# Altium project RK3576-SMC (021.0 A0).PrjPCB (part 2 of 3)

## Sheet RK3576-SMC.PMIC_BUCK (0021.0 A0).SchDoc
size 420 x 297 mm; Scale: -; DocumentType: Схема электрическая принципиальная; DocumentGOSTLIt1: ㅤ; DocumentGOSTLIt2: ㅤ; DocumentGOSTLIt3: ㅤ; DocumentGOSTNote: Элементы, отмеченные *, используются при трассировке печатной платы, в состав модуля не включаются; SheetNumber: 4; SheetTotal: 7; DocumentTypeShort: Э3; DocumentInvertoryNumber: ㅤ
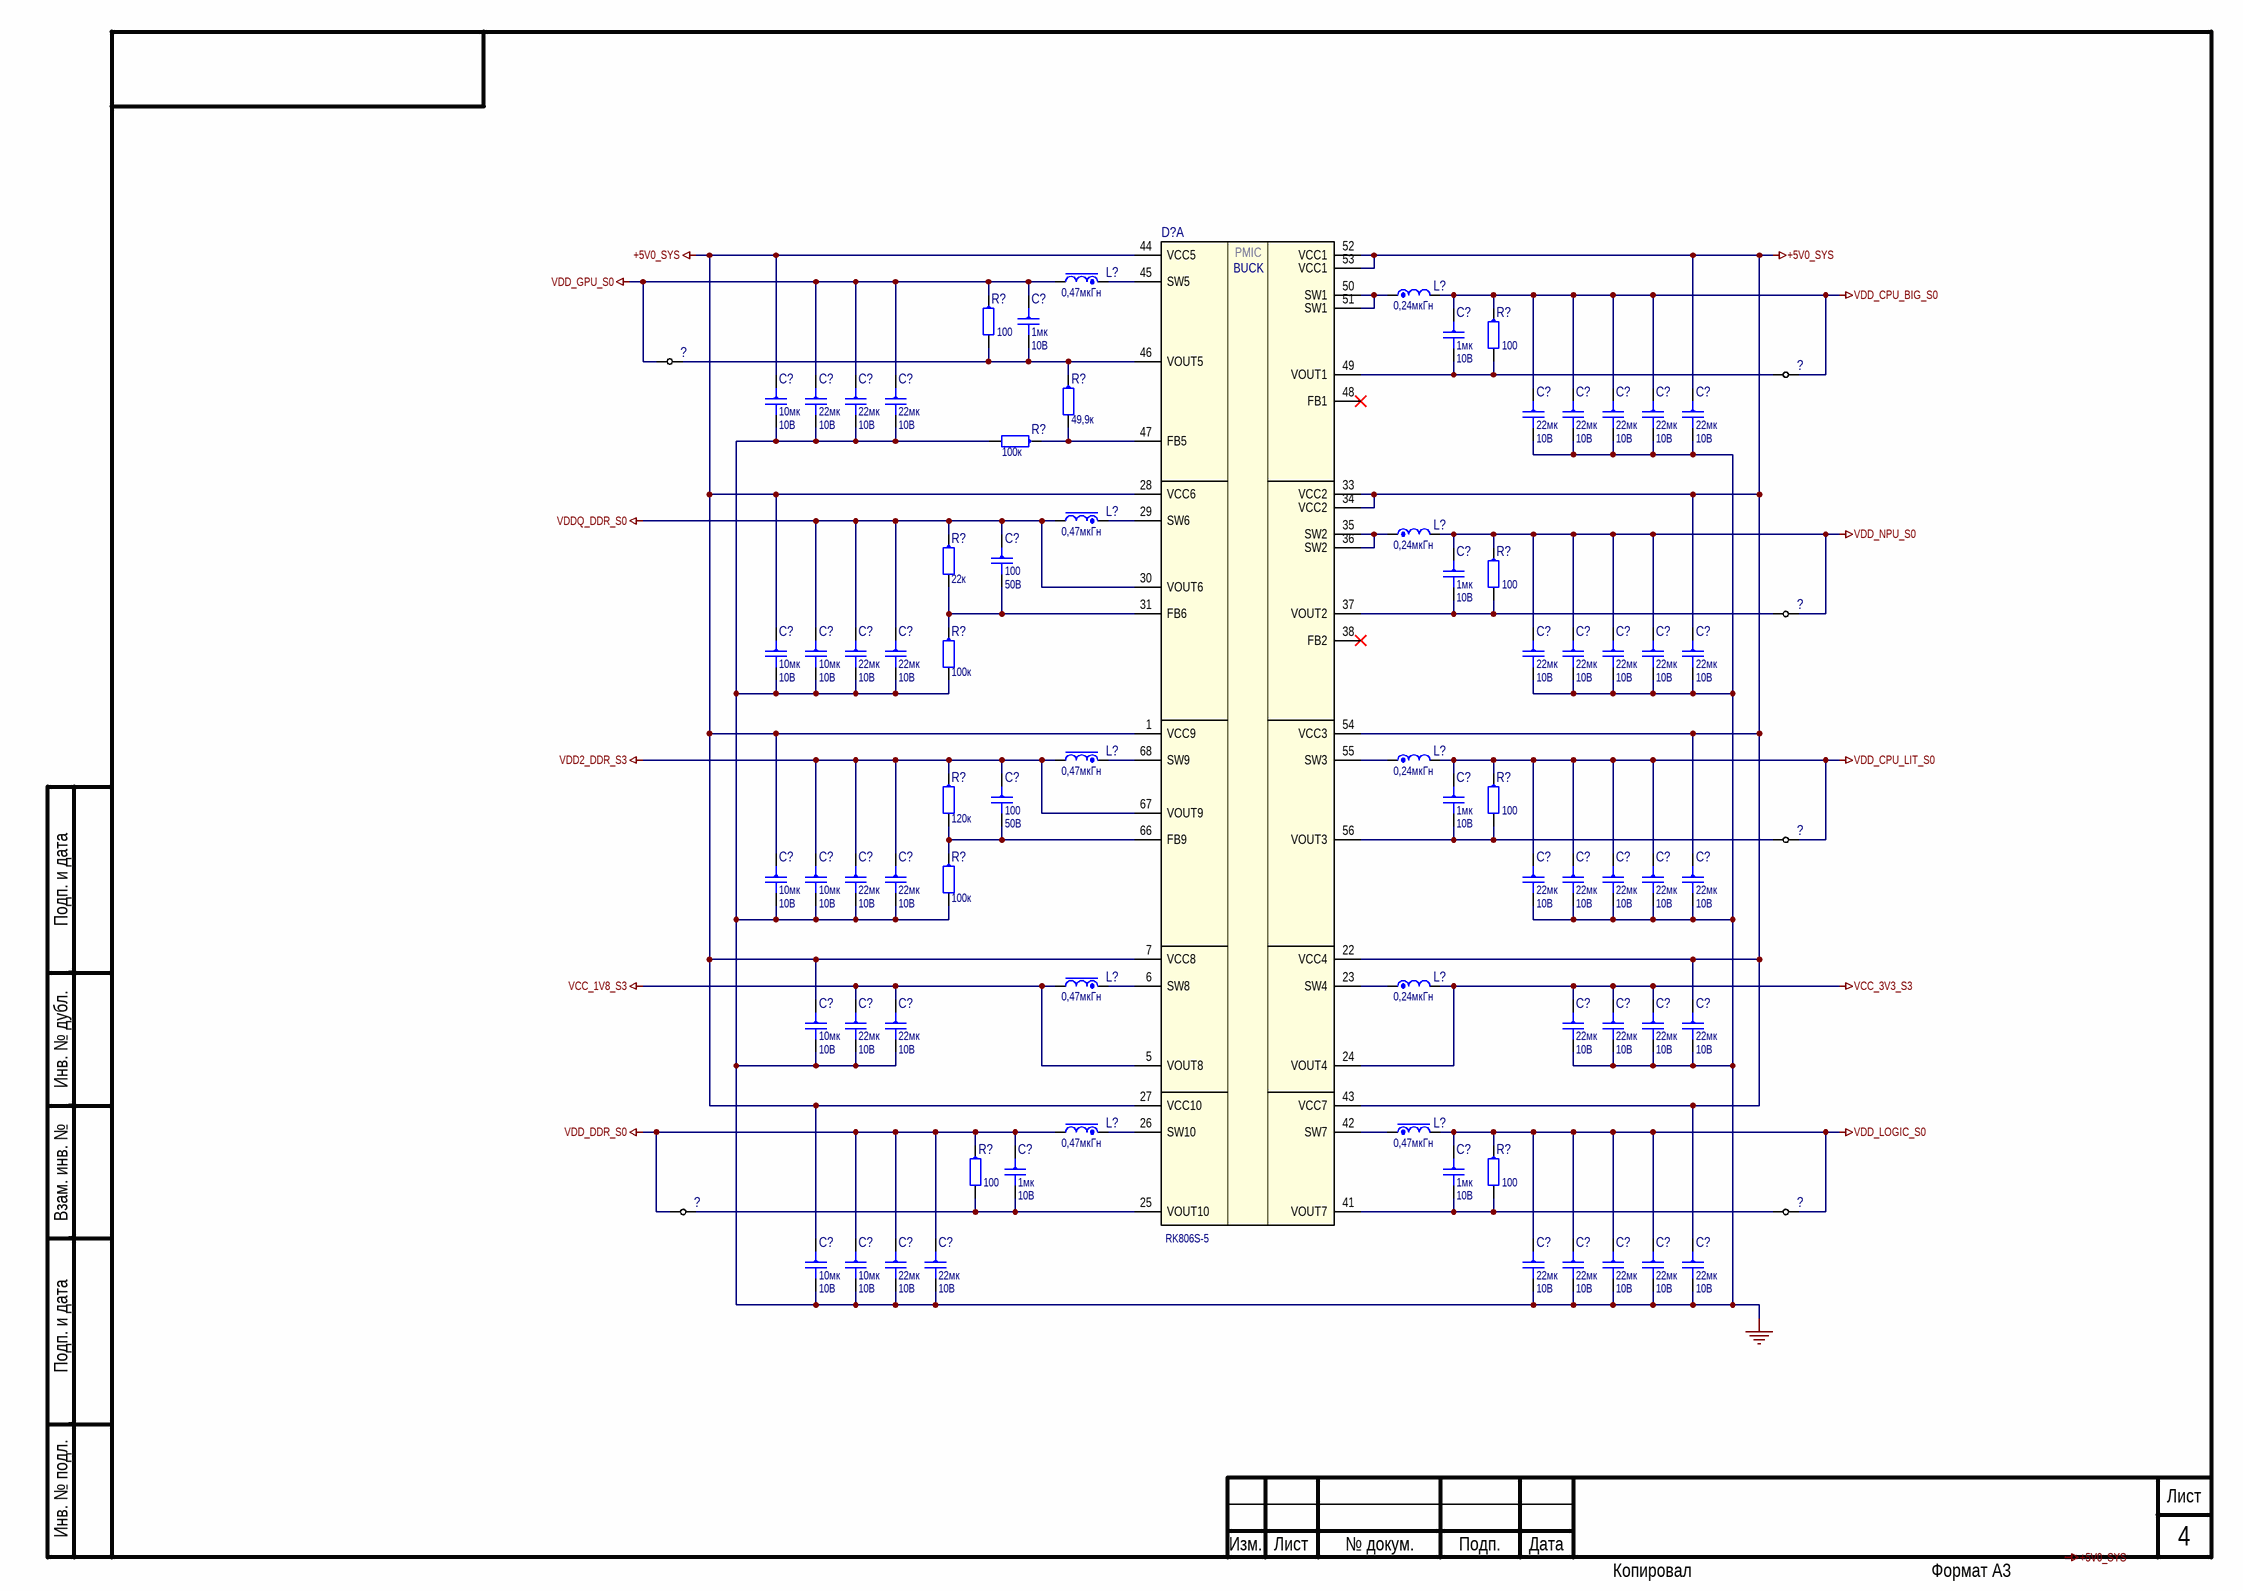
[diagram p3: RK3576-SMC.PMIC_BUCK (0021.0 A0).SchDoc]

### Parts
(Parts that share a designator on the sheet are numbered #1, #2 ... from top to bottom, then left to right.)
?#36  NetTie  [NetTie_0_6-1_25mm_close]  (value not drawn)  (net tie, no BOM)
?#37  NetTie  [NetTie_0_6-1_25mm_close]  (value not drawn)  (net tie, no BOM)
?#38  NetTie  [NetTie_0_6-1_25mm_close]  (value not drawn)  (net tie, no BOM)
?#39  NetTie  [NetTie_0_6-1_25mm_close]  (value not drawn)  (net tie, no BOM)
?#40  NetTie  [NetTie_0_6-1_25mm_close]  (value not drawn)  (net tie, no BOM)
?#41  NetTie  [NetTie_0_6-1_25mm_close]  (value not drawn)  (net tie, no BOM)
C?#1  1мк  Напряжение: 10В  [capc1005x55n]
C?#2  1мк  Напряжение: 10В  [capc1005x55n]
C?#3  10мк  Напряжение: 10В  [capc1608x100n]
C?#4  22мк  Напряжение: 10В  [capc1608x100n]
C?#5  22мк  Напряжение: 10В  [capc1608x100n]
C?#6  22мк  Напряжение: 10В  [capc1608x100n]
C?#7  22мк  Напряжение: 10В  [capc1608x100n]
C?#8  22мк  Напряжение: 10В  [capc1608x100n]
C?#9  22мк  Напряжение: 10В  [capc1608x100n]
C?#10  22мк  Напряжение: 10В  [capc1608x100n]
C?#11  22мк  Напряжение: 10В  [capc1608x100n]
C?#12  100  Напряжение: 50В  [capc1005x55n]
C?#13  1мк  Напряжение: 10В  [capc1005x55n]
C?#14  10мк  Напряжение: 10В  [capc1608x100n]
C?#15  10мк  Напряжение: 10В  [capc1608x100n]
C?#16  22мк  Напряжение: 10В  [capc1608x100n]
C?#17  22мк  Напряжение: 10В  [capc1608x100n]
C?#18  22мк  Напряжение: 10В  [capc1608x100n]
C?#19  22мк  Напряжение: 10В  [capc1608x100n]
C?#20  22мк  Напряжение: 10В  [capc1608x100n]
C?#21  22мк  Напряжение: 10В  [capc1608x100n]
C?#22  22мк  Напряжение: 10В  [capc1608x100n]
C?#23  100  Напряжение: 50В  [capc1005x55n]
C?#24  1мк  Напряжение: 10В  [capc1005x55n]
C?#25  10мк  Напряжение: 10В  [capc1608x100n]
C?#26  10мк  Напряжение: 10В  [capc1608x100n]
C?#27  22мк  Напряжение: 10В  [capc1608x100n]
C?#28  22мк  Напряжение: 10В  [capc1608x100n]
C?#29  22мк  Напряжение: 10В  [capc1608x100n]
C?#30  22мк  Напряжение: 10В  [capc1608x100n]
C?#31  22мк  Напряжение: 10В  [capc1608x100n]
C?#32  22мк  Напряжение: 10В  [capc1608x100n]
C?#33  22мк  Напряжение: 10В  [capc1608x100n]
C?#34  10мк  Напряжение: 10В  [capc1608x100n]
C?#35  22мк  Напряжение: 10В  [capc1608x100n]
C?#36  22мк  Напряжение: 10В  [capc1608x100n]
C?#37  22мк  Напряжение: 10В  [capc1608x100n]
C?#38  22мк  Напряжение: 10В  [capc1608x100n]
C?#39  22мк  Напряжение: 10В  [capc1608x100n]
C?#40  22мк  Напряжение: 10В  [capc1608x100n]
C?#41  1мк  Напряжение: 10В  [capc1005x55n]
C?#42  1мк  Напряжение: 10В  [capc1005x55n]
C?#43  10мк  Напряжение: 10В  [capc1608x100n]
C?#44  10мк  Напряжение: 10В  [capc1608x100n]
C?#45  22мк  Напряжение: 10В  [capc1608x100n]
C?#46  22мк  Напряжение: 10В  [capc1608x100n]
C?#47  22мк  Напряжение: 10В  [capc1608x100n]
C?#48  22мк  Напряжение: 10В  [capc1608x100n]
C?#49  22мк  Напряжение: 10В  [capc1608x100n]
C?#50  22мк  Напряжение: 10В  [capc1608x100n]
C?#51  22мк  Напряжение: 10В  [capc1608x100n]
D?#1  RK806S-5  [qfn35p700x700x90-69_hsn]  (part A of 3)
L?#1  0,47мкГн  [indm2016x100n]
L?#2  0,24мкГн  [inddfn250x200x120-2n_v1]
L?#3  0,47мкГн  [indm2016x100n]
L?#4  0,24мкГн  [inddfn250x200x120-2n_v1]
L?#5  0,47мкГн  [indm2016x100n]
L?#6  0,24мкГн  [inddfn250x200x120-2n_v1]
L?#7  0,47мкГн  [indm2016x100n]
L?#8  0,24мкГн  [inddfn250x200x120-2n_v1]
L?#9  0,47мкГн  [indm2016x100n]
L?#10  0,47мкГн  [indm2016x100n]
R?#52  100  [resc1005x40n]
R?#53  100  [resc1005x40n]
R?#54  49,9к  [resc1005x40n]
R?#55  100к  [resc1005x40n]
R?#56  22к  [resc1005x40n]
R?#57  100  [resc1005x40n]
R?#58  100к  [resc1005x40n]
R?#59  120к  [resc1005x40n]
R?#60  100  [resc1005x40n]
R?#61  100к  [resc1005x40n]
R?#62  100  [resc1005x40n]
R?#63  100  [resc1005x40n]

### Nets
+5V0_SYS: C?#3.1 C?#11.1 C?#14.1 C?#22.1 C?#25.1 C?#33.1 C?#34.1 C?#40.1 C?#43.1 C?#51.1 D?#1.1(VCC9) D?#1.7(VCC8) D?#1.22(VCC4) D?#1.27(VCC10) D?#1.28(VCC6) D?#1.33(VCC2) D?#1.34(VCC2) D?#1.43(VCC7) D?#1.44(VCC5) D?#1.52(VCC1) D?#1.53(VCC1) D?#1.54(VCC3)
SOM.GND: C?#3.2 C?#4.2 C?#5.2 C?#6.2 C?#7.2 C?#8.2 C?#9.2 C?#10.2 C?#11.2 C?#14.2 C?#15.2 C?#16.2 C?#17.2 C?#18.2 C?#19.2 C?#20.2 C?#21.2 C?#22.2 C?#25.2 C?#26.2 C?#27.2 C?#28.2 C?#29.2 C?#30.2 C?#31.2 C?#32.2 C?#33.2 C?#34.2 C?#35.2 C?#36.2 C?#37.2 C?#38.2 C?#39.2 C?#40.2 C?#43.2 C?#44.2 C?#45.2 C?#46.2 C?#47.2 C?#48.2 C?#49.2 C?#50.2 C?#51.2 R?#55.2 R?#58.2 R?#61.2
VCC_1V8_S3: C?#35.1 C?#36.1 D?#1.5(VOUT8) L?#7.2
VCC_3V3_S3: C?#37.1 C?#38.1 C?#39.1 D?#1.24(VOUT4) L?#8.2
VDD2_DDR_S3: C?#23.1 C?#26.1 C?#27.1 C?#28.1 D?#1.67(VOUT9) L?#5.2 R?#59.1
VDD_CPU_BIG_S0: ?#37.2 C?#2.1 C?#7.1 C?#8.1 C?#9.1 C?#10.1 L?#2.2 R?#53.1
VDD_CPU_LIT_S0: ?#39.2 C?#24.1 C?#29.1 C?#30.1 C?#31.1 C?#32.1 L?#6.2 R?#60.1
VDD_DDR_S0: ?#40.1 C?#41.1 C?#44.1 C?#45.1 C?#46.1 L?#9.2 R?#62.1
VDD_GPU_S0: ?#36.1 C?#1.1 C?#4.1 C?#5.1 C?#6.1 L?#1.2 R?#52.1
VDD_LOGIC_S0: ?#41.2 C?#42.1 C?#47.1 C?#48.1 C?#49.1 C?#50.1 L?#10.2 R?#63.1
VDD_NPU_S0: ?#38.2 C?#13.1 C?#18.1 C?#19.1 C?#20.1 C?#21.1 L?#4.2 R?#57.1
VDDQ_DDR_S0: C?#12.1 C?#15.1 C?#16.1 C?#17.1 D?#1.30(VOUT6) L?#3.2 R?#56.1
Net?#36_2: ?#36.2 C?#1.2 D?#1.46(VOUT5) R?#52.2 R?#54.1
Net?#37_1: ?#37.1 C?#2.2 D?#1.49(VOUT1) R?#53.2
Net?#38_1: ?#38.1 C?#13.2 D?#1.37(VOUT2) R?#57.2
Net?#39_1: ?#39.1 C?#24.2 D?#1.56(VOUT3) R?#60.2
Net?#40_2: ?#40.2 C?#41.2 D?#1.25(VOUT10) R?#62.2
Net?#41_1: ?#41.1 C?#42.2 D?#1.41(VOUT7) R?#63.2
NetC?#12_2: C?#12.2 D?#1.31(FB6) R?#56.2 R?#58.1
NetC?#23_2: C?#23.2 D?#1.66(FB9) R?#59.2 R?#61.1
NetD?#1_6: D?#1.6(SW8) L?#7.1
NetD?#1_23: D?#1.23(SW4) L?#8.1
NetD?#1_26: D?#1.26(SW10) L?#9.1
NetD?#1_29: D?#1.29(SW6) L?#3.1
NetD?#1_35: D?#1.35(SW2) D?#1.36(SW2) L?#4.1
NetD?#1_42: D?#1.42(SW7) L?#10.1
NetD?#1_45: D?#1.45(SW5) L?#1.1
NetD?#1_47: D?#1.47(FB5) R?#54.2 R?#55.1
NetD?#1_50: D?#1.50(SW1) D?#1.51(SW1) L?#2.1
NetD?#1_55: D?#1.55(SW3) L?#6.1
NetD?#1_68: D?#1.68(SW9) L?#5.1

Not connected (* = marked no-connect by the designer): D?#1 38(FB2)* 48(FB1)*

### Notes on the sheet
- Labels drawn without touching a wire or pin: +5V0_SYS
- Подп. и дата
- Инв. № дубл.
- Взам. инв. №
- Инв. № подл.
- Изм.
- Лист
- № докум.
- Подп.
- Дата
- Копировал
- Формат А3
- (in symbol RK806S-5, part A) PMIC; BUCK

### Library data of the parts
?#36-?#41 = NetTie_0.6-1.25_Close: Part_ID: ATB-00257; Rule: UNIONINDEX=0|RULEKIND=Clearance|NETSCOPE=DifferentNets|LAYERKIND=SameLayer|NAME=Schematic Clearance Constraint|GAP=0mil|GENERICCLEARANCE=0mil|IGNOREPADTOPADCLEARANCEINFOOTPRINT=TRUE|OBJECTCLEARANCES= |UNIT=Metric; Rule: UNIONINDEX=0|RULEKIND=PolygonConnect|NETSCOPE=AnyNet|LAYERKIND=SameLayer|NAME=Schematic Polygon Connect Style|CONNECTSTYLE=Direct|RELIEFCONDUCTORWIDTH=10mil|RELIEFENTRIES=4|POLYGONRELIEFANGLE=45 Angle|AIRGAPWIDTH=10mil|UNIT=Metric; Rule: UNIONINDEX=0|RULEKIND=ShortCircuit|NETSCOPE=AnyNet|LAYERKIND=SameLayer|NAME=Schematic Short-Circuit Constraint|ALLOWED=TRUE|UNIT=Metric; Тип ЭКБ: Элементы; Тип компонента: Перемычка; Автор: Чепиков И.В.; Part Number: NetTie_0.6-1.25_Close; Наименование: NetTie_0.6-1.25_Close; Value: -; Part_Number: NetTie_0.6-1.25_Close; Дата: 11.11.2024; Device: NetTie_0.6-1.25_Close; NameFromManufacturer: NetTie_0.6-1.25_Close
C?#1 C?#2 C?#13 C?#24 C?#41 C?#42 = CC0402KRX5R6BB105: Part_ID: ATB-00690; Manufacturer: Yageo; Schematic_Part: C_min_val,C_min,C_val,C; Тип ЭКБ: Конденсаторы; Наименование: 0402-X5R-10V-1uF±10%; Тип компонента: Конденсатор керамический; Value: 1uF; Voltage: 10V; Температура: -55 +85; PCB_Footprint: capc1005x55,capc1005x55n; Тип корпуса: Chip; Видоразмер: 1005; Вариант установки: Поверхностный; Код ERP: E2-00028722; Photo: Photos\Photos\Yageo_Capacitors.jpg; Автор: Чепиков И.В.; Точность: 10%; Device: 0402-X5R-10V-1uF±10%_Yageo; Library Ref 2: C; Library Ref 3: Cshort; Part Number: CC0402KRX5R6BB105; Datasheet: Datasheets\Capacitors\UPY-GPHC_X5R_4V-to-50V_30.pdf; Номинал: 1мк; Part_Number: CC0402KRX5R6BB105; Height: 0.55; Производитель: Yageo; Website: https://www.yageo.com/upload/media/product/productsearch/datasheet/mlcc/UPY-GPHC_X5R_4V-to-50V_30.pdf; Дата: 23.09.2024; ComponentLink1Description: UPY-GPHC_X5R_4V-to-50V_30.pdf; ComponentLink1URL: https://www.yageo.com/upload/media/product/productsearch/datasheet/mlcc/UPY-GPHC_X5R_4V-to-50V_30.pdf; NameFromManufacturer: CC0402KRX5R6BB105; Original PN: CC0402KRX5R6BB105
C?#3 C?#14 C?#15 C?#25 C?#26 C?#34 C?#43 C?#44 = CC0603KRX5R6BB106: Part_ID: ATB-01068; Manufacturer: Yageo; Schematic_Part: C_min_val,C_min,C_val,C; Тип ЭКБ: Конденсаторы; Наименование: 0603-X5R-10V-10uF±10%; Тип компонента: Конденсатор керамический; Value: 10uF; Voltage: 10V; Температура: -55 +85; Тип корпуса: Chip; Видоразмер: 1608; Вариант установки: Поверхностный; Код ERP: E2-00029011; Photo: Photos\Photos\Yageo_Capacitors.jpg; Автор: Чепиков И.В.; Точность: 10%; Device: 0603-X5R-10V-10uF±10%_Yageo; Library Ref 2: C; Library Ref 3: Cshort; Part Number: CC0603KRX5R6BB106; Datasheet: Datasheets\Capacitors\UPY-GPHC_X5R_4V-to-50V_30.pdf; Номинал: 10мк; Part_Number: CC0603KRX5R6BB106; PCB_Footprint: capc1608x100n; Height: 1; Производитель: Yageo; Website: https://www.yageo.com/upload/media/product/productsearch/datasheet/mlcc/UPY-GPHC_X5R_4V-to-50V_30.pdf; Дата: 25.09.2024; ComponentLink1Description: UPY-GPHC_X5R_4V-to-50V_30.pdf; ComponentLink1URL: https://www.yageo.com/upload/media/product/productsearch/datasheet/mlcc/UPY-GPHC_X5R_4V-to-50V_30.pdf; NameFromManufacturer: CC0603KRX5R6BB106; Original PN: CC0603KRX5R6BB106
C?#4-C?#11 C?#16-C?#22 C?#27-C?#33 C?#35-C?#40 C?#45-C?#51 = CC0603MRX5R6BB226: Part_ID: ATB-01072; Manufacturer: Yageo; Schematic_Part: C_min_val,C_min,C_val,C; Тип ЭКБ: Конденсаторы; Наименование: 0603-X5R-10V-22uF±20%; Тип компонента: Конденсатор керамический; Value: 22uF; Voltage: 10V; Температура: -55 +85; Тип корпуса: Chip; Видоразмер: 1608; Вариант установки: Поверхностный; Код ERP: E2-00006861; Photo: Photos\Photos\Yageo_Capacitors.jpg; Автор: Чепиков И.В.; Точность: 20%; Device: 0603-X5R-10V-22uF±20%_Yageo; Library Ref 2: C; Library Ref 3: Cshort; Part Number: CC0603MRX5R6BB226; Datasheet: Datasheets\Capacitors\UPY-GPHC_X5R_4V-to-50V_30.pdf; Номинал: 22мк; Part_Number: CC0603MRX5R6BB226; PCB_Footprint: capc1608x100n; Height: 1; Производитель: Yageo; Website: https://www.yageo.com/upload/media/product/productsearch/datasheet/mlcc/UPY-GPHC_X5R_4V-to-50V_30.pdf; Дата: 25.09.2024; ComponentLink1Description: UPY-GPHC_X5R_4V-to-50V_30.pdf; ComponentLink1URL: https://www.yageo.com/upload/media/product/productsearch/datasheet/mlcc/UPY-GPHC_X5R_4V-to-50V_30.pdf; NameFromManufacturer: CC0603MRX5R6BB226; Original PN: CC0603MRX5R6BB226
C?#12 C?#23 = CC0402JRNPO9BN101: Part_ID: ATB-03397; Manufacturer: Yageo; Schematic_Part: C_min_val,C_min,C_val,C; Тип ЭКБ: Конденсаторы; Наименование: 0402-NP0-50V-100pF±5%; Тип компонента: Конденсатор керамический; Value: 100pF; Voltage: 50V; Температура: -55 +125; PCB_Footprint: capc1005x55,capc1005x55n; Тип корпуса: Chip; Видоразмер: 1005; Вариант установки: Поверхностный; Photo: Photos\Photos\Yageo_Capacitors.jpg; Автор: Чепиков И.В.; Точность: 5%; Device: 0402-NP0-50V-100pF±5%_Yageo; Library Ref 2: C; Library Ref 3: Cshort; Part Number: CC0402JRNPO9BN101; Datasheet: Datasheets\Capacitors\UPY-GP_NP0_16V-to-250V_19.pdf; Номинал: 100; Part_Number: CC0402JRNPO9BN101; Height: 0.55; Производитель: Yageo; Website: https://www.yageo.com/upload/media/product/productsearch/datasheet/mlcc/UPY-GP_NP0_16V-to-250V_19.pdf; Дата: 15.10.2024; ComponentLink1Description: UPY-GP_NP0_16V-to-250V_19.pdf; ComponentLink1URL: https://www.yageo.com/upload/media/product/productsearch/datasheet/mlcc/UPY-GP_NP0_16V-to-250V_19.pdf; NameFromManufacturer: CC0402JRNPO9BN101; Original PN: CC0402JRNPO9BN101
D?#1 = RK806S-5: Power-management integrated circuit; Part_ID: ATB-08063; Manufacturer: Rockchip; Тип ЭКБ: Микросхемы; Тип компонента: Контроллеры; Voltage: 2.7 - 5.5; Температура: -40 +125; Тип корпуса: QFN7x7-68; Вариант установки: Поверхностный; Photo: Photos\Photos\Rockchip_RK806-1.jpg; Автор: Чепиков И.В.; Part Number: RK806S-5; Наименование: RK806S-5; Datasheet: Datasheets\Microcircuits\Rockchip_RK806S_Datasheet_V1.5.pdf; Schematic_Part: RK806-1; Value: RK806S-5; Part_Number: RK806S-5; PCB_Footprint: qfn35p700x700x90-69_hsn; Height: 0.9; Производитель: Rockchip; Дата: 16.09.2025; Device: RK806S-5; ComponentLink1Description: Rockchip_RK806S_Datasheet_V1.5.pdf; NameFromManufacturer: RK806S-5; Original PN: RK806S-5
L?#1 L?#3 L?#5 L?#7 L?#9 L?#10 = WIP201610P-R47ML: SMT 2016, 0,47 мкГн, 20%, 3,5 А; Part_ID: ATB-08092; Manufacturer: Inpaq; Schematic_Part: L,L_Core; Тип ЭКБ: Дроссели; Тип компонента: Дроссель; Value: 470nH; Температура: -40 +125; Тип корпуса: Molded; Вариант установки: Поверхностный; Photo: Photos\Photos\Inpaq_WIP201610P-R47ML.jpg; Автор: Чепиков И.В.; Library Ref 2: Lcore; ComponentLink1Description: WIP201610P_L_Series.pdf; ComponentLink1URL: https://www.lcsc.com/product-detail/C964105.html?s_z=n_WIP201610P-R47ML; Part Number: WIP201610P-R47ML; Наименование: WIP201610P-R47ML; Datasheet: Datasheets\Chokes\WIP201610P_L_Series.pdf; Номинал: 0,47мкГн; Part_Number: WIP201610P-R47ML; PCB_Footprint: indm2016x100n; Height: 1; Производитель: Inpaq; Website: https://www.lcsc.com/product-detail/C964105.html?s_z=n_WIP201610P-R47ML; Точность: 20%; Дата: 17.09.2025; Device: WIP201610P-R47ML; NameFromManufacturer: WIP201610P-R47ML; Original PN: WIP201610P-R47ML
L?#2 L?#4 L?#6 L?#8 = WPN252012HR24MT: SMT 2520, 0,24 мкГн, 20%, 4,05 А; Part_ID: ATB-10004; Manufacturer: Sunlord; Schematic_Part: L; Тип ЭКБ: Дроссели; Тип компонента: Катушка индуктивности; Value: 240nH; Температура: -40 +125; Тип корпуса: DFN; Вариант установки: Поверхностный; Код ERP: E2-00040440; Photo: Photos\Photos\Sunlord_WPN252012H1R0MT.jpg; Автор: Чепиков И.В.; ComponentLink1Description: WPN Series Sunlord.pdf; ComponentLink1URL: https://www.sunlordinc.com/uploads/files/20240807/cn/WPN%C2%A0Series%C2%A0of%C2%A0SMD%C2%A0Power%C2%A0Inductor.pdf; Part Number: WPN252012HR24MT; Наименование: WPN252012HR24MT; Datasheet: Datasheets\Chokes\WPN Series Sunlord.pdf; Номинал: 0,24мкГн; Part_Number: WPN252012HR24MT; PCB_Footprint: inddfn250x200x120-2n_v1; Height: 1.2; Производитель: Sunlord; Website: https://www.sunlordinc.com/uploads/files/20240807/cn/WPN%C2%A0Series%C2%A0of%C2%A0SMD%C2%A0Power%C2%A0Inductor.pdf; Точность: 20%; Дата: 27.05.2025; Device: WPN252012HR24MT; Library Ref 2: L; NameFromManufacturer: WPN252012HR24MT; Original PN: WPN252012HR24MT
R?#52 R?#53 R?#57 R?#60 R?#62 R?#63 = RC0402FR-07100RL: Резисторы (chip) общего назначения; Part_ID: ATB-00718; Manufacturer: Yageo; Schematic_Part: R_min_val,R_min,R_val,R; Наименование: 0402-0.063W-100-100ppm±1%; Voltage: 50V; Power: 0.063; Точность: ±1%; ТКС (от  -60 до +20 град): ± 100; Ряд: E24; Температура: -55 +155; Вариант установки: Поверхностный; Код ERP: E2-00025158; Photo: Photos\Photos\Yageo_RC0075-RC2512.jpg; Автор: Чепиков И.В.; Device: 0402-0.063W-100-100ppm±1%_Yageo; Library Ref 2: R; Part Number: RC0402FR-07100RL; Тип ЭКБ: Резисторы; Datasheet: Datasheets\Resistors\PYu-RC_Group_51_RoHS_L_12.pdf; Тип компонента: Резистор; Номинал: 100; Value: 100; ТКС (от +20 град до max): ± 100; Part_Number: RC0402FR-07100RL; PCB_Footprint: resc1005x40n; Тип корпуса: Chip; Height: 0.4; Производитель: Yageo; Website: https://www.yageo.com/upload/media/product/products/datasheet/rchip/PYu-RC_Group_51_RoHS_L_12.pdf; Дата: 25.09.2024; NameFromManufacturer: RC0402FR-07100RL; ComponentLink1URL: https://www.yageo.com/upload/media/product/products/datasheet/rchip/PYu-RC_Group_51_RoHS_L_12.pdf; ComponentLink1Description: PYu-RC_Group_51_RoHS_L_12.pdf; Original PN: RC0402FR-07100RL
R?#54 = RC0402FR-0749K9L: Резисторы (chip) общего назначения; Part_ID: ATB-08887; Manufacturer: Yageo; Schematic_Part: R_min_val,R_min,R_val,R; Наименование: 0402-0.063W-49.9K-100ppm±1%; Value: 49.9k; Voltage: 50V; Power: 0.063; Точность: ±1%; ТКС (от  -60 до +20 град): ± 100; Ряд: E96; Температура: -55 +155; Вариант установки: Поверхностный; Код ERP: E2-00000557; Photo: Photos\Photos\Yageo_RC0075-RC2512.jpg; Автор: Чепиков И.В.; Device: 0402-0.063W-49.9K-100ppm±1%_Yageo; Library Ref 2: R; Part Number: RC0402FR-0749K9L; Тип ЭКБ: Резисторы; Datasheet: Datasheets\Resistors\PYu-RC_Group_51_RoHS_L_12.pdf; Тип компонента: Резистор; Номинал: 49,9к; ТКС (от +20 град до max): ± 100; Part_Number: RC0402FR-0749K9L; PCB_Footprint: resc1005x40n; Тип корпуса: Chip; Height: 0.4; Производитель: Yageo; Website: https://www.yageo.com/upload/media/product/products/datasheet/rchip/PYu-RC_Group_51_RoHS_L_12.pdf; Дата: 23.12.2024; NameFromManufacturer: RC0402FR-0749K9L; ComponentLink1URL: https://www.yageo.com/upload/media/product/products/datasheet/rchip/PYu-RC_Group_51_RoHS_L_12.pdf; ComponentLink1Description: PYu-RC_Group_51_RoHS_L_12.pdf; Original PN: RC0402FR-0749K9L
R?#55 R?#58 R?#61 = RC0402FR-07100KL: Резисторы (chip) общего назначения; Part_ID: ATB-00517; Manufacturer: Yageo; Schematic_Part: R_min_val,R_min,R_val,R; Наименование: 0402-0.063W-100K-100ppm±1%; Value: 100k; Voltage: 50V; Power: 0.063; Точность: ±1%; ТКС (от  -60 до +20 град): ± 100; Ряд: E24; Температура: -55 +155; Вариант установки: Поверхностный; Код ERP: E2-00028265; Photo: Photos\Photos\Yageo_RC0075-RC2512.jpg; Автор: Чепиков И.В.; Device: 0402-0.063W-100K-100ppm±1%_Yageo; Library Ref 2: R; Part Number: RC0402FR-07100KL; Тип ЭКБ: Резисторы; Datasheet: Datasheets\Resistors\PYu-RC_Group_51_RoHS_L_12.pdf; Тип компонента: Резистор; Номинал: 100к; ТКС (от +20 град до max): ± 100; Part_Number: RC0402FR-07100KL; PCB_Footprint: resc1005x40n; Тип корпуса: Chip; Height: 0.4; Производитель: Yageo; Website: https://www.yageo.com/upload/media/product/products/datasheet/rchip/PYu-RC_Group_51_RoHS_L_12.pdf; Дата: 23.08.2024; NameFromManufacturer: RC0402FR-07100KL; ComponentLink1URL: https://www.yageo.com/upload/media/product/products/datasheet/rchip/PYu-RC_Group_51_RoHS_L_12.pdf; ComponentLink1Description: PYu-RC_Group_51_RoHS_L_12.pdf; Original PN: RC0402FR-07100KL
R?#56 = RC0402FR-0722KL: Резисторы (chip) общего назначения; Part_ID: ATB-00822; Manufacturer: Yageo; Schematic_Part: R_min_val,R_min,R_val,R; Наименование: 0402-0.063W-22K-100ppm±1%; Value: 22k; Voltage: 50V; Power: 0.063; Точность: ±1%; ТКС (от  -60 до +20 град): ± 100; Ряд: E24; Температура: -55 +155; Вариант установки: Поверхностный; Код ERP: E2-00028777; Photo: Photos\Photos\Yageo_RC0075-RC2512.jpg; Автор: Чепиков И.В.; Device: 0402-0.063W-22K-100ppm±1%_Yageo; Library Ref 2: R; Part Number: RC0402FR-0722KL; Тип ЭКБ: Резисторы; Datasheet: Datasheets\Resistors\PYu-RC_Group_51_RoHS_L_12.pdf; Тип компонента: Резистор; Номинал: 22к; ТКС (от +20 град до max): ± 100; Part_Number: RC0402FR-0722KL; PCB_Footprint: resc1005x40n; Тип корпуса: Chip; Height: 0.4; Производитель: Yageo; Website: https://www.yageo.com/upload/media/product/products/datasheet/rchip/PYu-RC_Group_51_RoHS_L_12.pdf; Дата: 25.09.2024; NameFromManufacturer: RC0402FR-0722KL; ComponentLink1URL: https://www.yageo.com/upload/media/product/products/datasheet/rchip/PYu-RC_Group_51_RoHS_L_12.pdf; ComponentLink1Description: PYu-RC_Group_51_RoHS_L_12.pdf; Original PN: RC0402FR-0722KL
R?#59 = RC0402FR-07120KL: Резисторы (chip) общего назначения; Part_ID: ATB-00834; Manufacturer: Yageo; Schematic_Part: R_min_val,R_min,R_val,R; Наименование: 0402-0.063W-120K-100ppm±1%; Value: 120k; Voltage: 50V; Power: 0.063; Точность: ±1%; ТКС (от  -60 до +20 град): ± 100; Ряд: E24; Температура: -55 +155; Вариант установки: Поверхностный; Код ERP: E2-00002809; Photo: Photos\Photos\Yageo_RC0075-RC2512.jpg; Автор: Чепиков И.В.; Device: 0402-0.063W-120K-100ppm±1%_Yageo; Library Ref 2: R; Part Number: RC0402FR-07120KL; Тип ЭКБ: Резисторы; Datasheet: Datasheets\Resistors\PYu-RC_Group_51_RoHS_L_12.pdf; Тип компонента: Резистор; Номинал: 120к; ТКС (от +20 град до max): ± 100; Part_Number: RC0402FR-07120KL; PCB_Footprint: resc1005x40n; Тип корпуса: Chip; Height: 0.4; Производитель: Yageo; Website: https://www.yageo.com/upload/media/product/products/datasheet/rchip/PYu-RC_Group_51_RoHS_L_12.pdf; Дата: 25.09.2024; NameFromManufacturer: RC0402FR-07120KL; ComponentLink1URL: https://www.yageo.com/upload/media/product/products/datasheet/rchip/PYu-RC_Group_51_RoHS_L_12.pdf; ComponentLink1Description: PYu-RC_Group_51_RoHS_L_12.pdf; Original PN: RC0402FR-07120KL

## Sheet RK3576-SMC.PMIC_LDO (0021.0 A0).SchDoc
size 420 x 297 mm; Scale: -; DocumentType: Схема электрическая принципиальная; DocumentGOSTLIt1: ㅤ; DocumentGOSTLIt2: ㅤ; DocumentGOSTLIt3: ㅤ; DocumentGOSTNote: Элементы, отмеченные *, используются при трассировке печатной платы, в состав модуля не включаются; SheetNumber: 5; SheetTotal: 7; DocumentTypeShort: Э3; DocumentInvertoryNumber: ㅤ
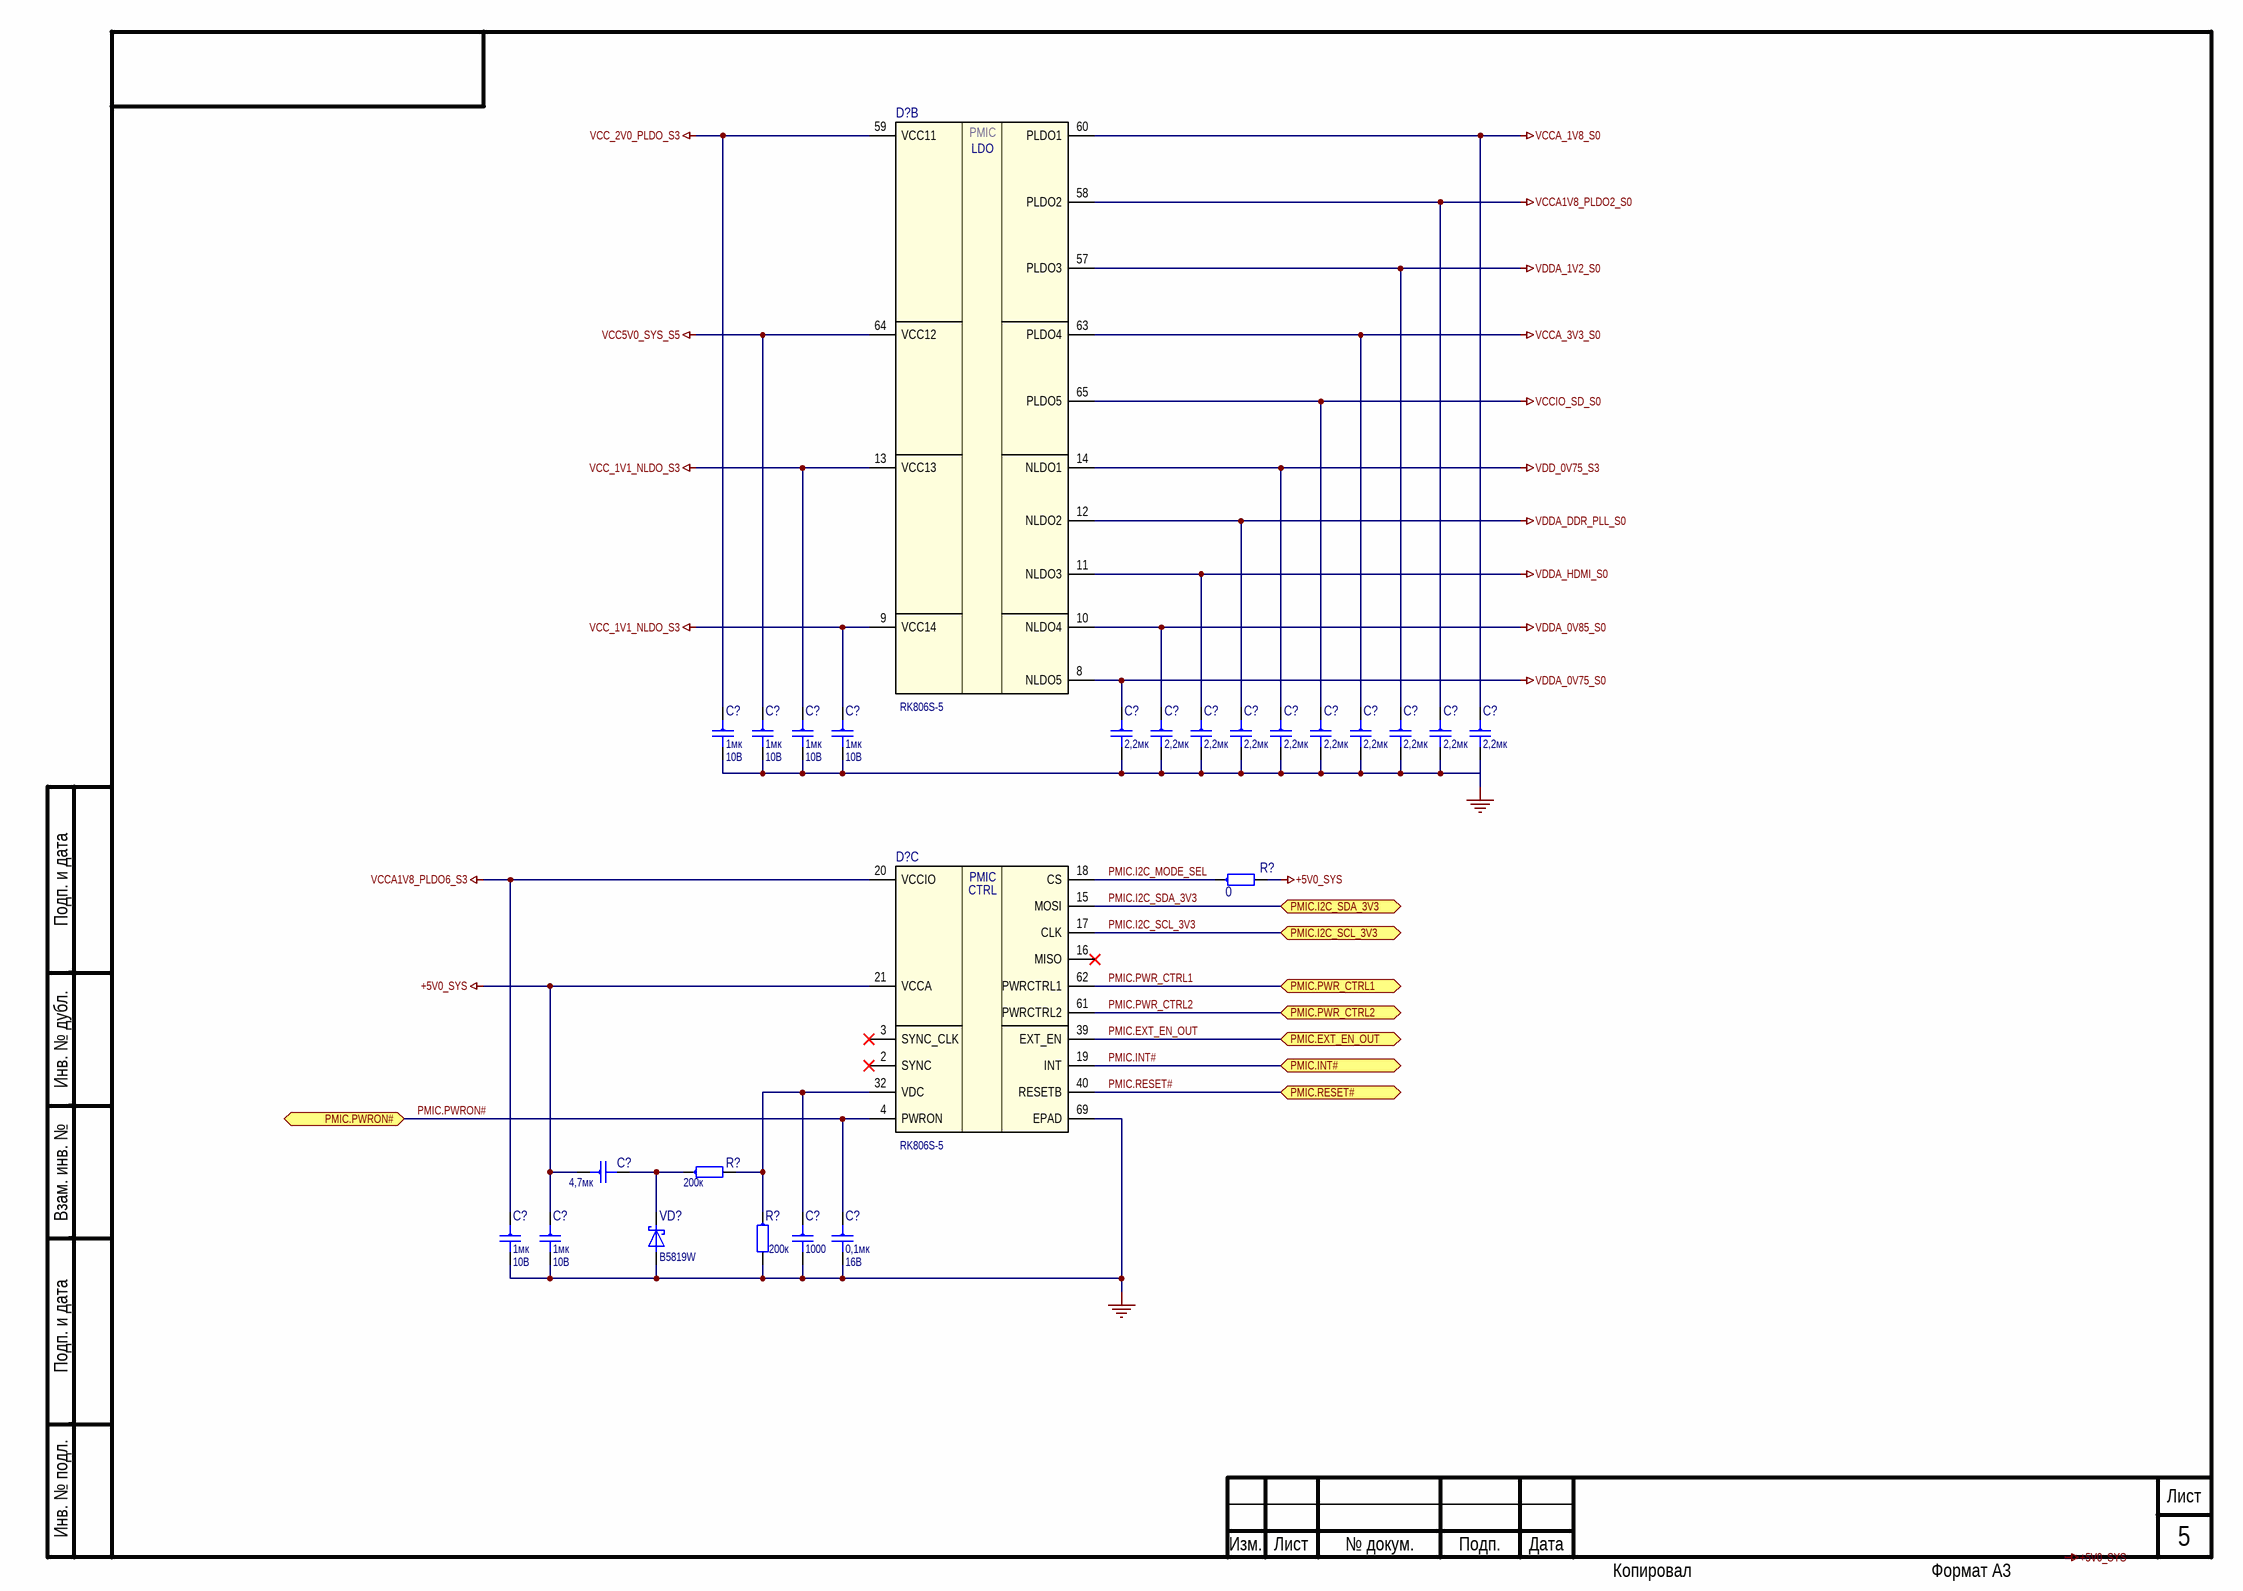
[diagram p4: RK3576-SMC.PMIC_LDO (0021.0 A0).SchDoc]

### Parts
(Parts that share a designator on the sheet are numbered #1, #2 ... from top to bottom, then left to right.)
C?#52  1мк  Напряжение: 10В  [capc1005x55n]
C?#53  1мк  Напряжение: 10В  [capc1005x55n]
C?#54  1мк  Напряжение: 10В  [capc1005x55n]
C?#55  1мк  Напряжение: 10В  [capc1005x55n]
C?#56  2,2мк  [capc1005x55n]
C?#57  2,2мк  [capc1005x55n]
C?#58  2,2мк  [capc1005x55n]
C?#59  2,2мк  [capc1005x55n]
C?#60  2,2мк  [capc1005x55n]
C?#61  2,2мк  [capc1005x55n]
C?#62  2,2мк  [capc1005x55n]
C?#63  2,2мк  [capc1005x55n]
C?#64  2,2мк  [capc1005x55n]
C?#65  2,2мк  [capc1005x55n]
C?#66  4,7мк  [capc1005x65n]
C?#67  1мк  Напряжение: 10В  [capc1005x55n]
C?#68  1мк  Напряжение: 10В  [capc1005x55n]
C?#69  1000  [capc1005x55n]
C?#70  0,1мк  Напряжение: 16В  [capc1005x55n]
D?#2  RK806S-5  [qfn35p700x700x90-69_hsn]  (part B of 3)
D?#3  RK806S-5  [qfn35p700x700x90-69_hsn]  (part C of 3)
R?#64  0  [resc0603x26n]
R?#65  200к  [resc1005x40n]
R?#66  200к  [resc1005x40n]
VD?  B5819W  [sod3716x125n]

### Ports
PMIC.EXT_EN_OUT (bidir), PMIC.I2C_SCL_3V3 (bidir), PMIC.I2C_SDA_3V3 (bidir), PMIC.INT# (bidir), PMIC.PWR_CTRL1 (bidir), PMIC.PWR_CTRL2 (bidir), PMIC.PWRON# (bidir), PMIC.RESET# (bidir)

### Nets
+5V0_SYS: C?#66.1 C?#68.1 D?#3.21(VCCA) R?#64.2
SOM.GND: C?#52.2 C?#53.2 C?#54.2 C?#55.2 C?#56.2 C?#57.2 C?#58.2 C?#59.2 C?#60.2 C?#61.2 C?#62.2 C?#63.2 C?#64.2 C?#65.2 C?#67.2 C?#68.2 C?#69.2 C?#70.2 D?#3.69(EPAD) R?#66.2 VD?.2
VCC5V0_SYS_S5: C?#53.1 D?#2.64(VCC12)
VCC_1V1_NLDO_S3: C?#54.1 C?#55.1 D?#2.9(VCC14) D?#2.13(VCC13)
VCC_2V0_PLDO_S3: C?#52.1 D?#2.59(VCC11)
VCCA1V8_PLDO2_S0: C?#64.1 D?#2.58(PLDO2)
VCCA1V8_PLDO6_S3: C?#67.1 D?#3.20(VCCIO)
VCCA_1V8_S0: C?#65.1 D?#2.60(PLDO1)
VCCA_3V3_S0: C?#62.1 D?#2.63(PLDO4)
VCCIO_SD_S0: C?#61.1 D?#2.65(PLDO5)
VDD_0V75_S3: C?#60.1 D?#2.14(NLDO1)
VDDA_0V75_S0: C?#56.1 D?#2.8(NLDO5)
VDDA_0V85_S0: C?#57.1 D?#2.10(NLDO4)
VDDA_1V2_S0: C?#63.1 D?#2.57(PLDO3)
VDDA_DDR_PLL_S0: C?#59.1 D?#2.12(NLDO2)
VDDA_HDMI_S0: C?#58.1 D?#2.11(NLDO3)
PMIC.EXT_EN_OUT: D?#3.39(EXT_EN) ; port PMIC.EXT_EN_OUT
PMIC.I2C_MODE_SEL: D?#3.18(CS) R?#64.1
PMIC.I2C_SCL_3V3: D?#3.17(CLK) ; port PMIC.I2C_SCL_3V3
PMIC.I2C_SDA_3V3: D?#3.15(MOSI) ; port PMIC.I2C_SDA_3V3
PMIC.INT#: D?#3.19(INT) ; port PMIC.INT#
PMIC.PWR_CTRL1: D?#3.62(PWRCTRL1) ; port PMIC.PWR_CTRL1
PMIC.PWR_CTRL2: D?#3.61(PWRCTRL2) ; port PMIC.PWR_CTRL2
PMIC.PWRON#: C?#70.1 D?#3.4(PWRON) ; port PMIC.PWRON#
PMIC.RESET#: D?#3.40(RESETB) ; port PMIC.RESET#
NetC?#66_2: C?#66.2 R?#65.1 VD?.1
NetC?#69_1: C?#69.1 D?#3.32(VDC) R?#65.2 R?#66.1

Not connected (* = marked no-connect by the designer): D?#3 2(SYNC)* 3(SYNC_CLK)* 16(MISO)*

### Notes on the sheet
- Labels drawn without touching a wire or pin: +5V0_SYS
- Подп. и дата
- Инв. № дубл.
- Взам. инв. №
- Инв. № подл.
- Изм.
- Лист
- № докум.
- Подп.
- Дата
- Копировал
- Формат А3
- (in symbol RK806S-5, part B) PMIC; LDO
- (in symbol RK806S-5, part C) PMIC; CTRL

### Library data of the parts
C?#52-C?#55 C?#67 C?#68 = CC0402KRX5R6BB105: as C?#1 on sheet RK3576-SMC.PMIC_BUCK (0021.0 A0); Part Number: CC0402KRX5R6BB105; Datasheet: Datasheets\Capacitors\UPY-GPHC_X5R_4V-to-50V_30.pdf; Номинал: 1мк; Part_Number: CC0402KRX5R6BB105; Height: 0.55; Производитель: Yageo; Website: https://www.yageo.com/upload/media/product/productsearch/datasheet/mlcc/UPY-GPHC_X5R_4V-to-50V_30.pdf; Дата: 23.09.2024; ComponentLink1Description: UPY-GPHC_X5R_4V-to-50V_30.pdf; ComponentLink1URL: https://www.yageo.com/upload/media/product/productsearch/datasheet/mlcc/UPY-GPHC_X5R_4V-to-50V_30.pdf; NameFromManufacturer: CC0402KRX5R6BB105; Original PN: CC0402KRX5R6BB105
C?#56-C?#65 = CC0402KRX5R5BB225: Part_ID: ATB-01027; Manufacturer: Yageo; Schematic_Part: C_min_val,C_min,C_val,C; Тип ЭКБ: Конденсаторы; Наименование: 0402-X5R-6.3V-2.2uF±10%; Тип компонента: Конденсатор керамический; Value: 2.2uF; Напряжение: 6,3В; Voltage: 6.3V; Температура: -55 +85; PCB_Footprint: capc1005x55,capc1005x55n; Тип корпуса: Chip; Видоразмер: 1005; Вариант установки: Поверхностный; Код ERP: E2-00010605; Photo: Photos\Photos\Yageo_Capacitors.jpg; Автор: Чепиков И.В.; Точность: 10%; Device: 0402-X5R-6.3V-2.2uF±10%_Yageo; Library Ref 2: C; Library Ref 3: Cshort; Part Number: CC0402KRX5R5BB225; Datasheet: Datasheets\Capacitors\UPY-GPHC_X5R_4V-to-50V_30.pdf; Номинал: 2,2мк; Part_Number: CC0402KRX5R5BB225; Height: 0.55; Производитель: Yageo; Website: https://www.yageo.com/upload/media/product/productsearch/datasheet/mlcc/UPY-GPHC_X5R_4V-to-50V_30.pdf; Дата: 25.09.2024; ComponentLink1Description: UPY-GPHC_X5R_4V-to-50V_30.pdf; ComponentLink1URL: https://www.yageo.com/upload/media/product/productsearch/datasheet/mlcc/UPY-GPHC_X5R_4V-to-50V_30.pdf; NameFromManufacturer: CC0402KRX5R5BB225; Original PN: CC0402KRX5R5BB225
C?#66 = CC0402KRX5R6BB475: Part_ID: ATB-01272; Manufacturer: Yageo; Schematic_Part: C_min_val,C_min,C_val,C; Тип ЭКБ: Конденсаторы; Наименование: 0402-X5R-10V-4.7uF±10%; Тип компонента: Конденсатор керамический; Value: 4.7uF; Напряжение: 10В; Voltage: 10V; Температура: -55 +85; Тип корпуса: Chip; Видоразмер: 1005; Вариант установки: Поверхностный; Код ERP: E2-00034571; Photo: Photos\Photos\Yageo_Capacitors.jpg; Автор: Чепиков И.В.; Точность: 10%; Device: 0402-X5R-10V-4.7uF±10%_Yageo; Library Ref 2: C; Library Ref 3: Cshort; Part Number: CC0402KRX5R6BB475; Datasheet: Datasheets\Capacitors\UPY-GPHC_X5R_4V-to-50V_30.pdf; Номинал: 4,7мк; Part_Number: CC0402KRX5R6BB475; PCB_Footprint: capc1005x65n; Height: 0.65; Производитель: Yageo; Website: https://www.yageo.com/upload/media/product/productsearch/datasheet/mlcc/UPY-GPHC_X5R_4V-to-50V_30.pdf; Дата: 09.10.2024; ComponentLink1Description: UPY-GPHC_X5R_4V-to-50V_30.pdf; ComponentLink1URL: https://www.yageo.com/upload/media/product/productsearch/datasheet/mlcc/UPY-GPHC_X5R_4V-to-50V_30.pdf; NameFromManufacturer: CC0402KRX5R6BB475; Original PN: CC0402KRX5R6BB475
C?#69 = CC0402JRNPO9BN102: Part_ID: ATB-03443; Manufacturer: Yageo; Schematic_Part: C_min_val,C_min,C_val,C; Тип ЭКБ: Конденсаторы; Наименование: 0402-NP0-50V-1nF±5%; Тип компонента: Конденсатор керамический; Value: 1nF; Напряжение: 50В; Voltage: 50V; Температура: -55 +125; PCB_Footprint: capc1005x55,capc1005x55n; Тип корпуса: Chip; Видоразмер: 1005; Вариант установки: Поверхностный; Photo: Photos\Photos\Yageo_Capacitors.jpg; Автор: Чепиков И.В.; Точность: 5%; Device: 0402-NP0-50V-1nF±5%_Yageo; Library Ref 2: C; Library Ref 3: Cshort; Part Number: CC0402JRNPO9BN102; Datasheet: Datasheets\Capacitors\UPY-GP_NP0_16V-to-250V_19.pdf; Номинал: 1000; Part_Number: CC0402JRNPO9BN102; Height: 0.55; Производитель: Yageo; Website: https://www.yageo.com/upload/media/product/productsearch/datasheet/mlcc/UPY-GP_NP0_16V-to-250V_19.pdf; Дата: 15.10.2024; ComponentLink1Description: UPY-GP_NP0_16V-to-250V_19.pdf; ComponentLink1URL: https://www.yageo.com/upload/media/product/productsearch/datasheet/mlcc/UPY-GP_NP0_16V-to-250V_19.pdf; NameFromManufacturer: CC0402JRNPO9BN102; Original PN: CC0402JRNPO9BN102
C?#70 = CC0402KRX7R7BB104: Part_ID: ATB-02516; Manufacturer: Yageo; Schematic_Part: C_min_val,C_min,C_val,C; Тип ЭКБ: Конденсаторы; Наименование: 0402-X7R-16V-100nF±10%; Тип компонента: Конденсатор керамический; Value: 100nF; Voltage: 16V; Температура: -55 +125; PCB_Footprint: capc1005x55,capc1005x55n; Тип корпуса: Chip; Видоразмер: 1005; Вариант установки: Поверхностный; Код ERP: E2-00028731; Photo: Photos\Photos\Yageo_Capacitors.jpg; Автор: Чепиков И.В.; Точность: 10%; Device: 0402-X7R-16V-100nF±10%_Yageo; Library Ref 2: C; Library Ref 3: Cshort; Part Number: CC0402KRX7R7BB104; Datasheet: Datasheets\Capacitors\UPY-GPHC_X7R_6.3V-to-250V_23.pdf; Номинал: 0,1мк; Part_Number: CC0402KRX7R7BB104; Height: 0.55; Производитель: Yageo; Website: https://www.yageo.com/upload/media/product/productsearch/datasheet/mlcc/UPY-GPHC_X7R_6.3V-to-250V_23.pdf; Дата: 10.10.2024; ComponentLink1Description: UPY-GPHC_X7R_6.3V-to-250V_23.pdf; ComponentLink1URL: https://www.yageo.com/upload/media/product/productsearch/datasheet/mlcc/UPY-GPHC_X7R_6.3V-to-250V_23.pdf; NameFromManufacturer: CC0402KRX7R7BB104; Original PN: CC0402KRX7R7BB104
D?#2 D?#3 = RK806S-5: as D?#1 on sheet RK3576-SMC.PMIC_BUCK (0021.0 A0); Part Number: RK806S-5; Наименование: RK806S-5; Datasheet: Datasheets\Microcircuits\Rockchip_RK806S_Datasheet_V1.5.pdf; Schematic_Part: RK806-1; Value: RK806S-5; Part_Number: RK806S-5; PCB_Footprint: qfn35p700x700x90-69_hsn; Height: 0.9; Производитель: Rockchip; Дата: 16.09.2025; Device: RK806S-5; ComponentLink1Description: Rockchip_RK806S_Datasheet_V1.5.pdf; NameFromManufacturer: RK806S-5; Original PN: RK806S-5
R?#64 = RC0201JR-070RL: Резисторы (chip) общего назначения; Part_ID: ATB-09733; Manufacturer: Yageo; Schematic_Part: R_min_val,R_min,R_val,R; Наименование: 0201-0.05W-0±5%; Voltage: 30V; Power: 0.05; Точность: ±5%; Температура: -55 +125; Вариант установки: Поверхностный; Код ERP: E2-00008416; Photo: Photos\Photos\Yageo_RC0075-RC2512.jpg; Автор: Чепиков И.В.; Device: 0201-0.05W-0±5%_Yageo; Library Ref 2: R; Part Number: RC0201JR-070RL; Тип ЭКБ: Резисторы; Datasheet: Datasheets\Resistors\PYu-RC_Group_51_RoHS_L_12.pdf; Тип компонента: Резистор; Номинал: 0; Value: 0; Part_Number: RC0201JR-070RL; PCB_Footprint: resc0603x26n; Тип корпуса: Chip; Height: 0.26; Производитель: Yageo; Website: https://www.yageo.com/upload/media/product/products/datasheet/rchip/PYu-RC_Group_51_RoHS_L_12.pdf; Дата: 14.01.2025; NameFromManufacturer: RC0201JR-070RL; ComponentLink1URL: https://www.yageo.com/upload/media/product/products/datasheet/rchip/PYu-RC_Group_51_RoHS_L_12.pdf; ComponentLink1Description: PYu-RC_Group_51_RoHS_L_12.pdf; Original PN: RC0201JR-070RL
R?#65 R?#66 = RC0402FR-07200KL: Резисторы (chip) общего назначения; Part_ID: ATB-00839; Manufacturer: Yageo; Schematic_Part: R_min_val,R_min,R_val,R; Наименование: 0402-0.063W-200K-100ppm±1%; Value: 200k; Voltage: 50V; Power: 0.063; Точность: ±1%; ТКС (от  -60 до +20 град): ± 100; Ряд: E24; Температура: -55 +155; Вариант установки: Поверхностный; Код ERP: E2-00028775; Photo: Photos\Photos\Yageo_RC0075-RC2512.jpg; Автор: Чепиков И.В.; Device: 0402-0.063W-200K-100ppm±1%_Yageo; Library Ref 2: R; Part Number: RC0402FR-07200KL; Тип ЭКБ: Резисторы; Datasheet: Datasheets\Resistors\PYu-RC_Group_51_RoHS_L_12.pdf; Тип компонента: Резистор; Номинал: 200к; ТКС (от +20 град до max): ± 100; Part_Number: RC0402FR-07200KL; PCB_Footprint: resc1005x40n; Тип корпуса: Chip; Height: 0.4; Производитель: Yageo; Website: https://www.yageo.com/upload/media/product/products/datasheet/rchip/PYu-RC_Group_51_RoHS_L_12.pdf; Дата: 25.09.2024; NameFromManufacturer: RC0402FR-07200KL; ComponentLink1URL: https://www.yageo.com/upload/media/product/products/datasheet/rchip/PYu-RC_Group_51_RoHS_L_12.pdf; ComponentLink1Description: PYu-RC_Group_51_RoHS_L_12.pdf; Original PN: RC0402FR-07200KL
VD? = B5819W: Schottky; VRRM=40V, VF=600(900)mV, IF=1(3)A, IR=1mA, CD=120pF; Part_ID: ATB-00135; Manufacturer: SMC; Schematic_Part: VD_sch_min,VD_sch; Тип ЭКБ: Диоды; Тип компонента: Диод Шоттки; Температура: -55 +150; Тип корпуса: SOD123; Вариант установки: Поверхностный; Код ERP: E2-00013594; Photo: Photos\Photos\SMC_B5819W.jpg; Автор: Чепиков И.В.; Library Ref 2: VDsch; Part Number: B5819W; Наименование: B5819W; Datasheet: Datasheets\Diodes\B5817W-B5819W.pdf; Value: B5819W; Part_Number: B5819W; PCB_Footprint: sod3716x125n; Height: 1.25; Weight: 0.01; Производитель: SMC; Website: https://www.smc-diodes.com/Products/Discrete/Schottky-Rectifiers/B5819W.html; Дата: 03.04.2024; Device: B5819W; ComponentLink1Description: B5817W-B5819W.pdf; ComponentLink1URL: https://www.smc-Diodes.com/Products/Discrete/Schottky-Rectifiers/B5819W.html; NameFromManufacturer: B5819W; Original PN: B5819W